# EAGLE schematic photocell mk2 (EAGLE 6.5.0)
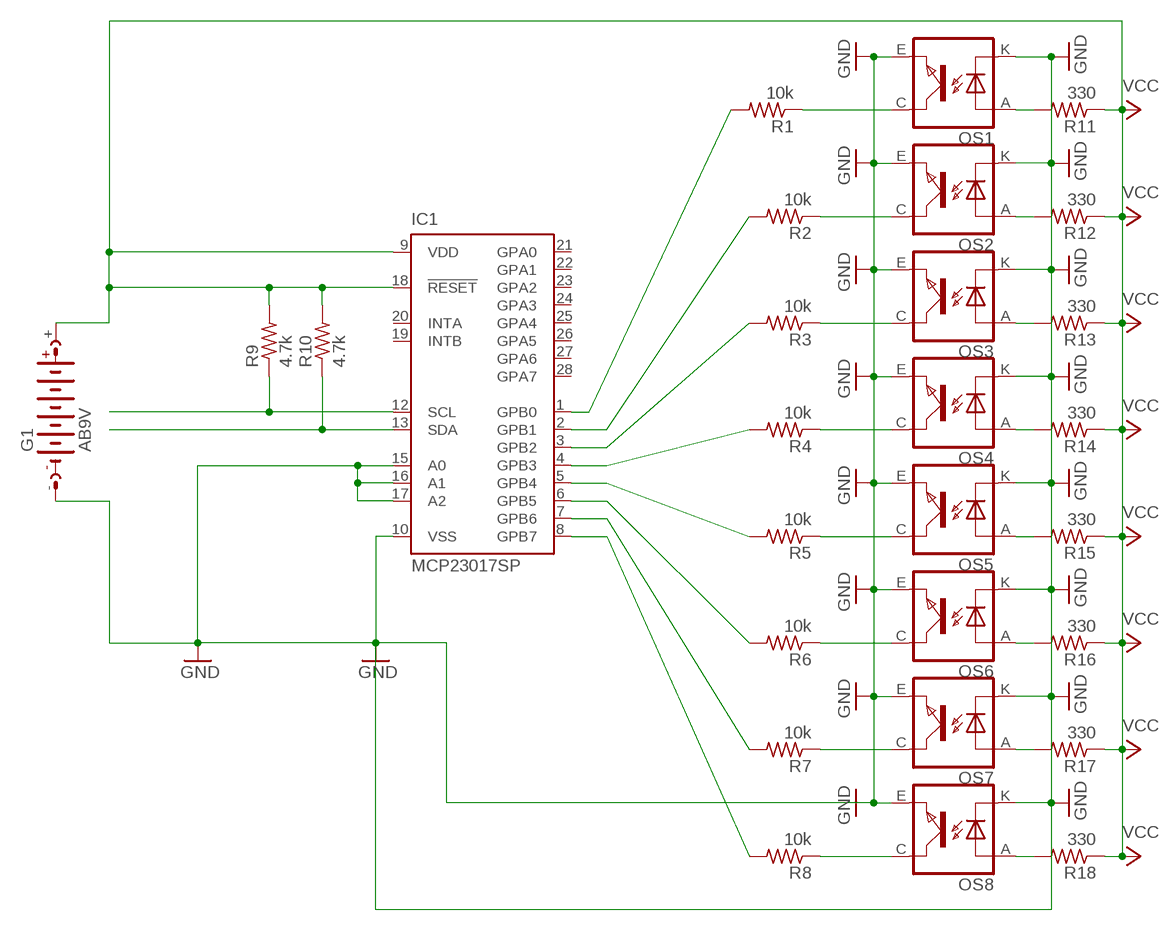
[diagram p0: schematic, sheet 1]

## Parts
G1  AB9V  [AB9V]
IC1  MCP23017SP  [DIL28-3]
OS1  TCRT5000  [TCRT5000]
OS2  TCRT5000  [TCRT5000]
OS3  TCRT5000  [TCRT5000]
OS4  TCRT5000  [TCRT5000]
OS5  TCRT5000  [TCRT5000]
OS6  TCRT5000  [TCRT5000]
OS7  TCRT5000  [TCRT5000]
OS8  TCRT5000  [TCRT5000]
R1  10k  R-US_0204/7  [0204/7]
R2  10k  R-US_0204/7  [0204/7]
R3  10k  R-US_0204/7  [0204/7]
R4  10k  R-US_0204/7  [0204/7]
R5  10k  R-US_0204/7  [0204/7]
R6  10k  R-US_0204/7  [0204/7]
R7  10k  R-US_0204/7  [0204/7]
R8  10k  R-US_0204/7  [0204/7]
R9  4.7k  R-US_0204/7  [0204/7]
R10  4.7k  R-US_0204/7  [0204/7]
R11  330  R-US_0204/7  [0204/7]
R12  330  R-US_0204/7  [0204/7]
R13  330  R-US_0204/7  [0204/7]
R14  330  R-US_0204/7  [0204/7]
R15  330  R-US_0204/7  [0204/7]
R16  330  R-US_0204/7  [0204/7]
R17  330  R-US_0204/7  [0204/7]
R18  330  R-US_0204/7  [0204/7]

## Nets
GND: G1.- IC1.10(VSS) IC1.15(A0) IC1.16(A1) IC1.17(A2) OS1.E(EMITTER) OS1.K(CATHODE) OS2.E(EMITTER) OS2.K(CATHODE) OS3.E(EMITTER) OS3.K(CATHODE) OS4.E(EMITTER) OS4.K(CATHODE) OS5.E(EMITTER) OS5.K(CATHODE) OS6.E(EMITTER) OS6.K(CATHODE) OS7.E(EMITTER) OS7.K(CATHODE) OS8.E(EMITTER) OS8.K(CATHODE)
N$1: IC1.1(GPB0) R1.2
N$2: OS1.C(COLLECTOR) R1.1
N$3: IC1.2(GPB1) R2.2
N$4: IC1.3(GPB2) R3.2
N$5: IC1.4(GPB3) R4.2
N$6: IC1.5(GPB4) R5.2
N$7: IC1.6(GPB5) R6.2
N$8: IC1.7(GPB6) R7.2
N$9: IC1.8(GPB7) R8.2
N$10: OS2.C(COLLECTOR) R2.1
N$11: OS3.C(COLLECTOR) R3.1
N$12: OS4.C(COLLECTOR) R4.1
N$13: OS5.C(COLLECTOR) R5.1
N$14: OS6.C(COLLECTOR) R6.1
N$15: OS7.C(COLLECTOR) R7.1
N$16: OS8.C(COLLECTOR) R8.1
N$17: IC1.13(SDA) R10.1
N$18: IC1.12(SCL) R9.1
N$20: OS8.A(ANODE) R18.2
N$21: OS7.A(ANODE) R17.2
N$22: OS6.A(ANODE) R16.2
N$23: OS5.A(ANODE) R15.2
N$24: OS4.A(ANODE) R14.2
N$25: OS3.A(ANODE) R13.2
N$26: OS1.A(ANODE) R11.2
N$27: OS2.A(ANODE) R12.2
VCC: G1.+ IC1.9(VDD) IC1.18(!RESET) R9.2 R10.2 R11.1 R12.1 R13.1 R14.1 R15.1 R16.1 R17.1 R18.1
Unconnected: IC1.19(INTB) IC1.20(INTA) IC1.21(GPA0) IC1.22(GPA1) IC1.23(GPA2) IC1.24(GPA3) IC1.25(GPA4) IC1.26(GPA5) IC1.27(GPA6) IC1.28(GPA7)

## Library data of the parts
G1 = battery:AB9V: 9-V BATTERY CLIP
IC1 = microchip:MCP23017: http://ww1.microchip.com/downloads/en/DeviceDoc/21952a.pdf Source: http://ww1.microchip.com/downloads/en/DeviceDoc/21952a.pdf; MF: MICROCHIP; MPN: MCP23017-E/SP; OC_FARNELL: 1332088; OC_NEWARK: 31K2959
OS1-OS8 = tcrt5000:TCRT5000
R1-R18 = resistor:R-US_: RESISTOR, American symbol

## Net classes
0 default: width 0.305 mm, drill 0.508 mm, clearance 0.254 mm